# Altium schematic sheet captivate_bswp.SchDoc: TICAPEVM_BSWP Capacitive Touch Panel PCB
size Letter; Date: Not shown in title block; ApprovedBy: Not shown in title block; CheckedBy: Not shown in title block; Author: Not shown in title block; CompanyName: Not shown in title block; DrawnBy: W. Schnoor; Engineer: Not shown in title block; Organization: Not shown in title block; Address1: Not shown in title block; Address2: Not shown in title block; Address3: Not shown in title block; Address4: Not shown in title block; DocumentNumber: 1; Revision: Use project parameter SCH_Rev; SheetNumber: 1; SheetTotal: 1; PageSetup: Record=PageOptions|CenterHorizontal=True|CenterVertical=True|PrintScale=1.00|XCorrection=1.00|YCorrection=1.00|PrintKind=0|BorderSize=5000000|LeftOffset=0|BottomOffset=0|Orientation=2|PaperLength=1000|PaperWidth=1000|Scale=100|PaperSource=15|PrintQuality=600|MediaType=1|DitherType=10|PaperKind=Letter|PrintScaleMode=1; CurrentTime: Not shown in title block; CurrentDate: Not shown in title block; Time: Not shown in title block; DocumentFullPathAndName: Not shown in title block; DocumentName: Not shown in title block; ModifiedDate: Not shown in title block; ImagePath: Not shown in title block
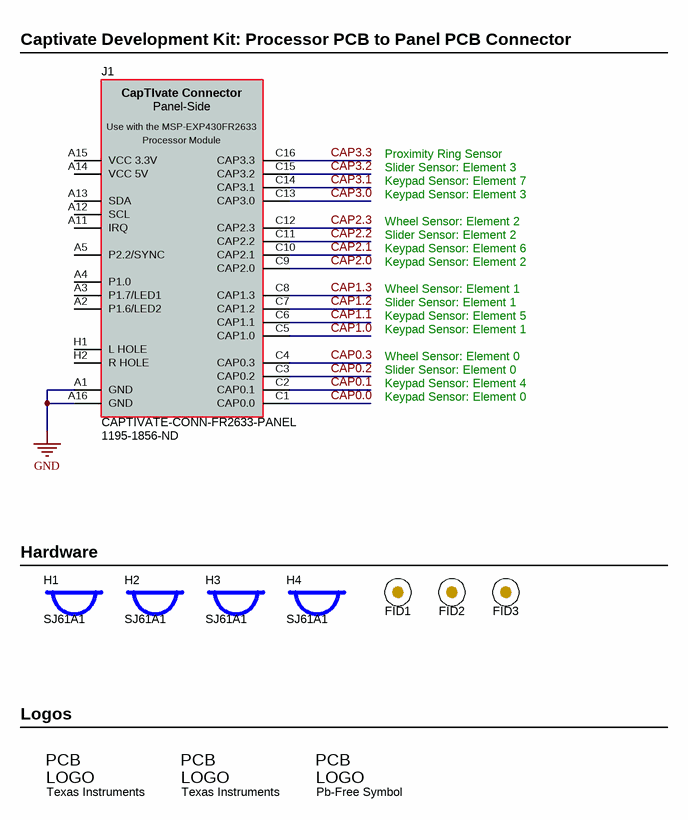
[diagram p0: captivate_bswp.SchDoc]

## Parts
FID1  Fiducial  [Fiducial10-20]  (value not drawn)
FID2  Fiducial  [Fiducial10-20]  (value not drawn)
FID3  Fiducial  [Fiducial10-20]  (value not drawn)
H1  SJ61A1  [Bumpon_SJ61A1]
H2  SJ61A1  [Bumpon_SJ61A1]
H3  SJ61A1  [Bumpon_SJ61A1]
H4  SJ61A1  [Bumpon_SJ61A1]
J1  CAPTIVATE-CONN-FR2633-PANEL  Supplier Part Number 1: 1195-1856-ND  [CAPTIVATE-CONN-48]
LeadFreeLogo  Pb-Free Symbol  [Pb-Free_Overlay_Medium]  (no BOM)
TI_LOGO_1  Texas Instruments  [TI_Horizontal_Overlay_Medium]  (no BOM)
TI_LOGO_2  Texas Instruments  [TI_Horizontal_Overlay_Medium]  (no BOM)

## Nets
GND: J1.A1(GND) J1.A16(GND)
CAP0.0: J1.C1(CAP0.0)
CAP0.1: J1.C2(CAP0.1)
CAP0.2: J1.C3(CAP0.2)
CAP0.3: J1.C4(CAP0.3)
CAP1.0: J1.C5(CAP1.0)
CAP1.1: J1.C6(CAP1.1)
CAP1.2: J1.C7(CAP1.2)
CAP1.3: J1.C8(CAP1.3)
CAP2.0: J1.C9(CAP2.0)
CAP2.1: J1.C10(CAP2.1)
CAP2.2: J1.C11(CAP2.2)
CAP2.3: J1.C12(CAP2.3)
CAP3.0: J1.C13(CAP3.0)
CAP3.1: J1.C14(CAP3.1)
CAP3.2: J1.C15(CAP3.2)
CAP3.3: J1.C16(CAP3.3)

Not connected (* = marked no-connect by the designer): J1 A2(P1.6/LED2) A3(P1.7/LED1) A4(P1.0) A5(P2.2/SYNC) A11(IRQ) A12(SCL) A13(SDA) A14(VCC_5V) A15(VCC_3.3V) H1(L_HOLE) H2(R_HOLE)

## Notes on the sheet
- Captivate Development Kit: Processor PCB to Panel PCB Connector
- Proximity Ring Sensor
- Keypad Sensor: Element 3
- Keypad Sensor: Element 7
- Slider Sensor: Element 3
- Wheel Sensor: Element 2
- Keypad Sensor: Element 2
- Keypad Sensor: Element 6
- Slider Sensor: Element 2
- Wheel Sensor: Element 1
- Keypad Sensor: Element 1
- Keypad Sensor: Element 5
- Slider Sensor: Element 1
- Wheel Sensor: Element 0
- Keypad Sensor: Element 0
- Keypad Sensor: Element 4
- Slider Sensor: Element 0
- (near H1) Hardware
- (near TI_LOGO_1) Logos
- Drawn By:
- SVN Rev:
- Number:
- TID #:
- Orderable:
- Rev:
- Sheet Title:
- File:
- Project Title:
- Designed for:
- Assembly Variant:
- Mod. Date:
- Sheet:
- Size:
- of
- Letter
- http://www.ti.com
- Texas Instruments and/or its licensors do not warrant the accuracy or completeness of this specification or any information contained therein. Texas Instruments and/or its licensors do not warrant that this design will meet the specifications, will be suitable for your application or fit for any particular purpose, or will operate in an implementation. Texas Instruments and/or its licensors do not warrant that the design is production worthy. You should completely validate and test your design implementation to confirm the system functionality for your application.
- Engineer:
- Contact:
- © Texas Instruments
- (in symbol CAPTIVATE-CONN-MSP-EXP430FR2633-PANEL) CapTIvate Connector; Panel-Side; Use with the MSP-EXP430FR2633; Processor Module
- (in symbol Pb-Free) PCB; LOGO
- (in symbol TI_Logo) PCB; LOGO

## Library data of the parts
FID1-FID3 = Fiducial: Fiducial mark.  There is nothing to buy or mount.; SymbolCreator: codlsc; SymbolVersion: 2009-11-4; CompType: Fiducial; PackageReference: N/A; ClassName: FiducialMark; Manufacturer: N/A; PartNumber: N/A; MountType: N/A; Publisher: Texas Instruments; LatestRevisionDate: 2014-10-27; LatestRevisionNote: Added Alternate PartNumber and Alternate Manufacturer parameters to appropriate components.
H1-H4 = SJ61A1: Bumpon, Cylindrical, 0.312 X 0.200, Black; Manufacturer: 3M; SymbolCreator: a0412235; SymbolVersion: 2012-03-04; CompType: Bumpon; PartNumber: SJ61A1; RoHS: Y; PackageReference: Black Bumpon; MountType: N/A; ComponentLink1Description: Datasheet Link; ComponentLink1URL: http://multimedia.3m.com/mws/mediawebserver?mwsId=66666UF6EVsSyXTtOxTXoxMtEVtQEVs6EVs6EVs6E666666--&fn=SJxxA1.pdf; Publisher: Texas Instruments; LatestRevisionDate: 2014-11-19; Supplier 1: Digi-Key; Supplier Part Number 1: SJ5746-0-ND; Supplier 2: Mouser; Supplier Part Number 2: 517-SJ-61A1
J1 = CAPTIVATE-CONN-MSP-EXP430FR2633-PANEL: CapTIvate Panel-Side Connector, 3x16, 100mil, TH, RA, M, MSP-EXP430FR2633; Manufacturer: Used in BOM report; SymbolCreator: a0273983; U/M: EA, IN, or GM; SymbolVersion: 2015-1-5; MountType: SMT, TH, or N/A; RoHS: Y; PartNumber: CAPTIVATE-CONN-FR2633-PANEL; PackageReference: eg:  0603, used in PnP report; ComponentLink1Description: Datasheet Link; CompType: Connector; Alternate PartNumber: -; Alternate Manufacturer: -; Supplier 1: Digi-Key; Supplier 2: Digi-Key; Supplier Part Number 2: 609-2112-ND
LeadFreeLogo = Pb-Free: SymbolCreator: a0412235; SymbolVersion: 2011-08-22; Published: 2009-03-03; Publisher: Texas Instruments; LatestRevisionDate: 2014-11-20
TI_LOGO_1 TI_LOGO_2 = TI_Logo: Texas Instrument Corporate Signature; SymbolCreator: a0412235; SymbolVersion: 2011-08-22; ClassName: Logo; Published: 2009-03-03; Publisher: Texas Instruments; LatestRevisionDate: 2014-11-20